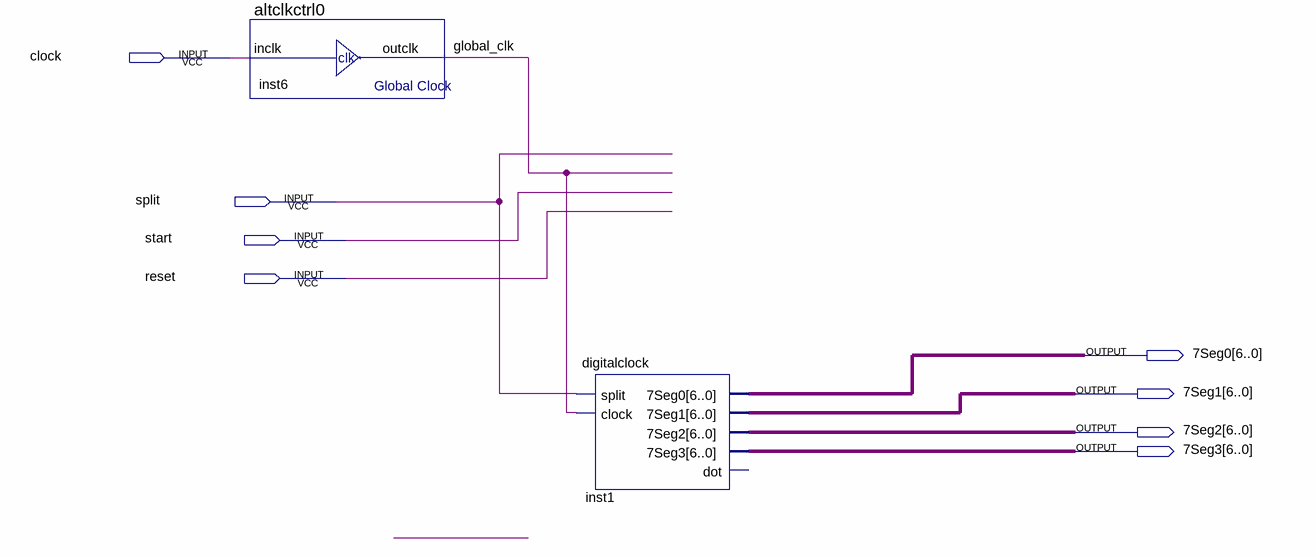
[diagram p0: schematic sheet]
// Quartus schematic clk-stp TOP.bdf as structural Verilog: 2 symbols, 8 pins
module \clk-stp_TOP  (
  input  clock,
  input  split,
  input  start,
  input  reset,
  output [6:0] \7Seg0 ,
  output [6:0] \7Seg1 ,
  output [6:0] \7Seg2 ,
  output [6:0] \7Seg3 
);

  wire global_clk;

  altclkctrl0 inst6 (.inclk(clock), .outclk(global_clk));
  digitalclock inst1 (
    .split(split), .clock(global_clk), .\7Seg0 (\7Seg0 ), .\7Seg1 (\7Seg1 ), .\7Seg2 (\7Seg2 ),
    .\7Seg3 (\7Seg3 ));  // open: dot
endmodule
